# Altium project Probe-Scope v1.0.PrjPCB
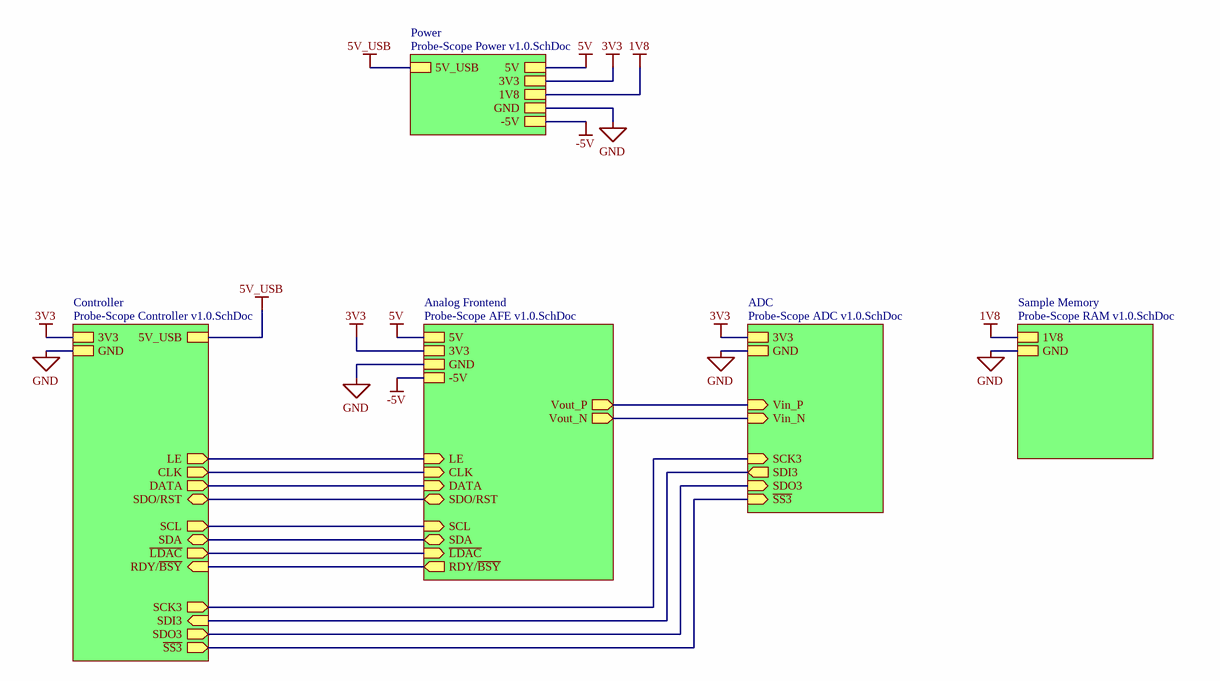
[diagram p0: Probe-Scope Top v1.0.SchDoc]
sheetcount: 6; schematic: SCH0100; revisionfull: v1.0.0; revision: v1.0; assembly: ASP0100
6 sheets, 135 parts. Net scope: strictly hierarchical (ports join the sheet entries above them; power ports are local).
Board file: Probe-Scope v1.0.PcbDoc
Sheets:
  Probe-Scope Top v1.0.SchDoc
    Analog Frontend = Probe-Scope AFE v1.0.SchDoc
    ADC = Probe-Scope ADC v1.0.SchDoc
    Sample Memory = Probe-Scope RAM v1.0.SchDoc
    Controller = Probe-Scope Controller v1.0.SchDoc
    Power = Probe-Scope Power v1.0.SchDoc

## Sheet Probe-Scope Top v1.0.SchDoc: Probe-Scope: Overview
size Letter; CompanyName: Probe-Scope; Organization: Probe-Scope; Address1: Probe-Scope: Unified USB; Address2: Oscilloscope Probe; Address3: ©2019 M. Omo, J. Rowley,; DocumentNumber: SCH0100; Revision: v1.0.0; SheetNumber: 1; SheetTotal: 6; PageSetup: Record=PageOptions|CenterHorizontal=True|CenterVertical=True|PrintScale=0.96|XCorrection=1.00|YCorrection=1.00|PrintKind=1|BorderSize=5000000|LeftOffset=0|BottomOffset=0|Orientation=2|PaperLength=1000|PaperWidth=1000|Scale=100|PaperSource=7|PrintQuality=-4|MediaType=1|DitherType=10|PaperKind=11x17|PrintScaleMode=1; Assembly: ASP0100; Address4: K. Hall, released under the; License: CERN OHL v1.2

### Sub-sheets
ADC = Probe-Scope ADC v1.0.SchDoc: Vin_P (in), Vin_N (in), 3V3, GND, SDO3 (in), ~{SS3} (in), SDI3 (out), SCK3 (in)
Analog Frontend = Probe-Scope AFE v1.0.SchDoc: -5V, Vout_N (out), RDY/~{BSY} (out), CLK (in), Vout_P (out), GND, ~{LDAC} (in), SDA (bidir), DATA (in), 3V3, LE (in), 5V, SDO/RST (bidir), SCL (in)
Controller = Probe-Scope Controller v1.0.SchDoc: SCK3 (out), SDO3 (out), SDO/RST (bidir), DATA (out), ~{LDAC} (out), ~{SS3} (out), SDI3 (in), SCL (out), CLK (out), RDY/~{BSY} (in), SDA (bidir), LE (out), 3V3, GND, 5V_USB
Power = Probe-Scope Power v1.0.SchDoc: 3V3, 5V_USB, 5V, -5V, 1V8, GND
Sample Memory = Probe-Scope RAM v1.0.SchDoc: GND, 1V8

### Nets
1V8: sheet Sample Memory/1V8, sheet Power/1V8
3V3: sheet Analog Frontend/3V3, sheet ADC/3V3, sheet Controller/3V3, sheet Power/3V3
5V: sheet Analog Frontend/5V, sheet Power/5V
5V_USB: sheet Controller/5V_USB, sheet Power/5V_USB
-5V: sheet Analog Frontend/-5V, sheet Power/-5V
GND: sheet Analog Frontend/GND, sheet ADC/GND, sheet Sample Memory/GND, sheet Controller/GND, sheet Power/GND
DAC_RDY: sheet Analog Frontend/RDY/~{BSY}, sheet Controller/RDY/~{BSY}
~{LDAC}: sheet Analog Frontend/~{LDAC}, sheet Controller/~{LDAC}
~{SS3}: sheet ADC/~{SS3}, sheet Controller/~{SS3}
~{SS4}: sheet Analog Frontend/LE, sheet Controller/LE
SCK3: sheet ADC/SCK3, sheet Controller/SCK3
SCK4: sheet Analog Frontend/CLK, sheet Controller/CLK
SCL4: sheet Analog Frontend/SCL, sheet Controller/SCL
SDA4: sheet Analog Frontend/SDA, sheet Controller/SDA
SDI3: sheet ADC/SDI3, sheet Controller/SDI3
SDI4: sheet Analog Frontend/SDO/RST, sheet Controller/SDO/RST
SDO3: sheet ADC/SDO3, sheet Controller/SDO3
SDO4: sheet Analog Frontend/DATA, sheet Controller/DATA
Vin_N: sheet Analog Frontend/Vout_N, sheet ADC/Vin_N
Vin_P: sheet Analog Frontend/Vout_P, sheet ADC/Vin_P

### Notes on the sheet
- Title:
- Asm:
- Date:
- Variant:
- Time:
- Number:
- Sheet
- of
- Rev:
- File:

## Sheet Probe-Scope AFE v1.0.SchDoc: Probe-Scope: Analog Frontend
size Tabloid; CompanyName: Probe-Scope; Organization: Probe-Scope; Address1: Probe-Scope: Unified USB; Address2: Oscilloscope Probe; Address3: ©2019 M. Omo, J. Rowley,; DocumentNumber: SCH0100; Revision: v1.0.0; SheetNumber: 3; SheetTotal: 6; PageSetup: Record=PageOptions|CenterHorizontal=True|CenterVertical=True|PrintScale=0.96|XCorrection=1.00|YCorrection=1.00|PrintKind=1|BorderSize=5000000|LeftOffset=0|BottomOffset=0|Orientation=2|PaperLength=1000|PaperWidth=1000|Scale=100|PaperSource=7|PrintQuality=-4|MediaType=1|DitherType=10|PaperKind=11x17|PrintScaleMode=1; Assembly: ASP0100; Address4: K. Hall, released under the; License: CERN OHL v1.2
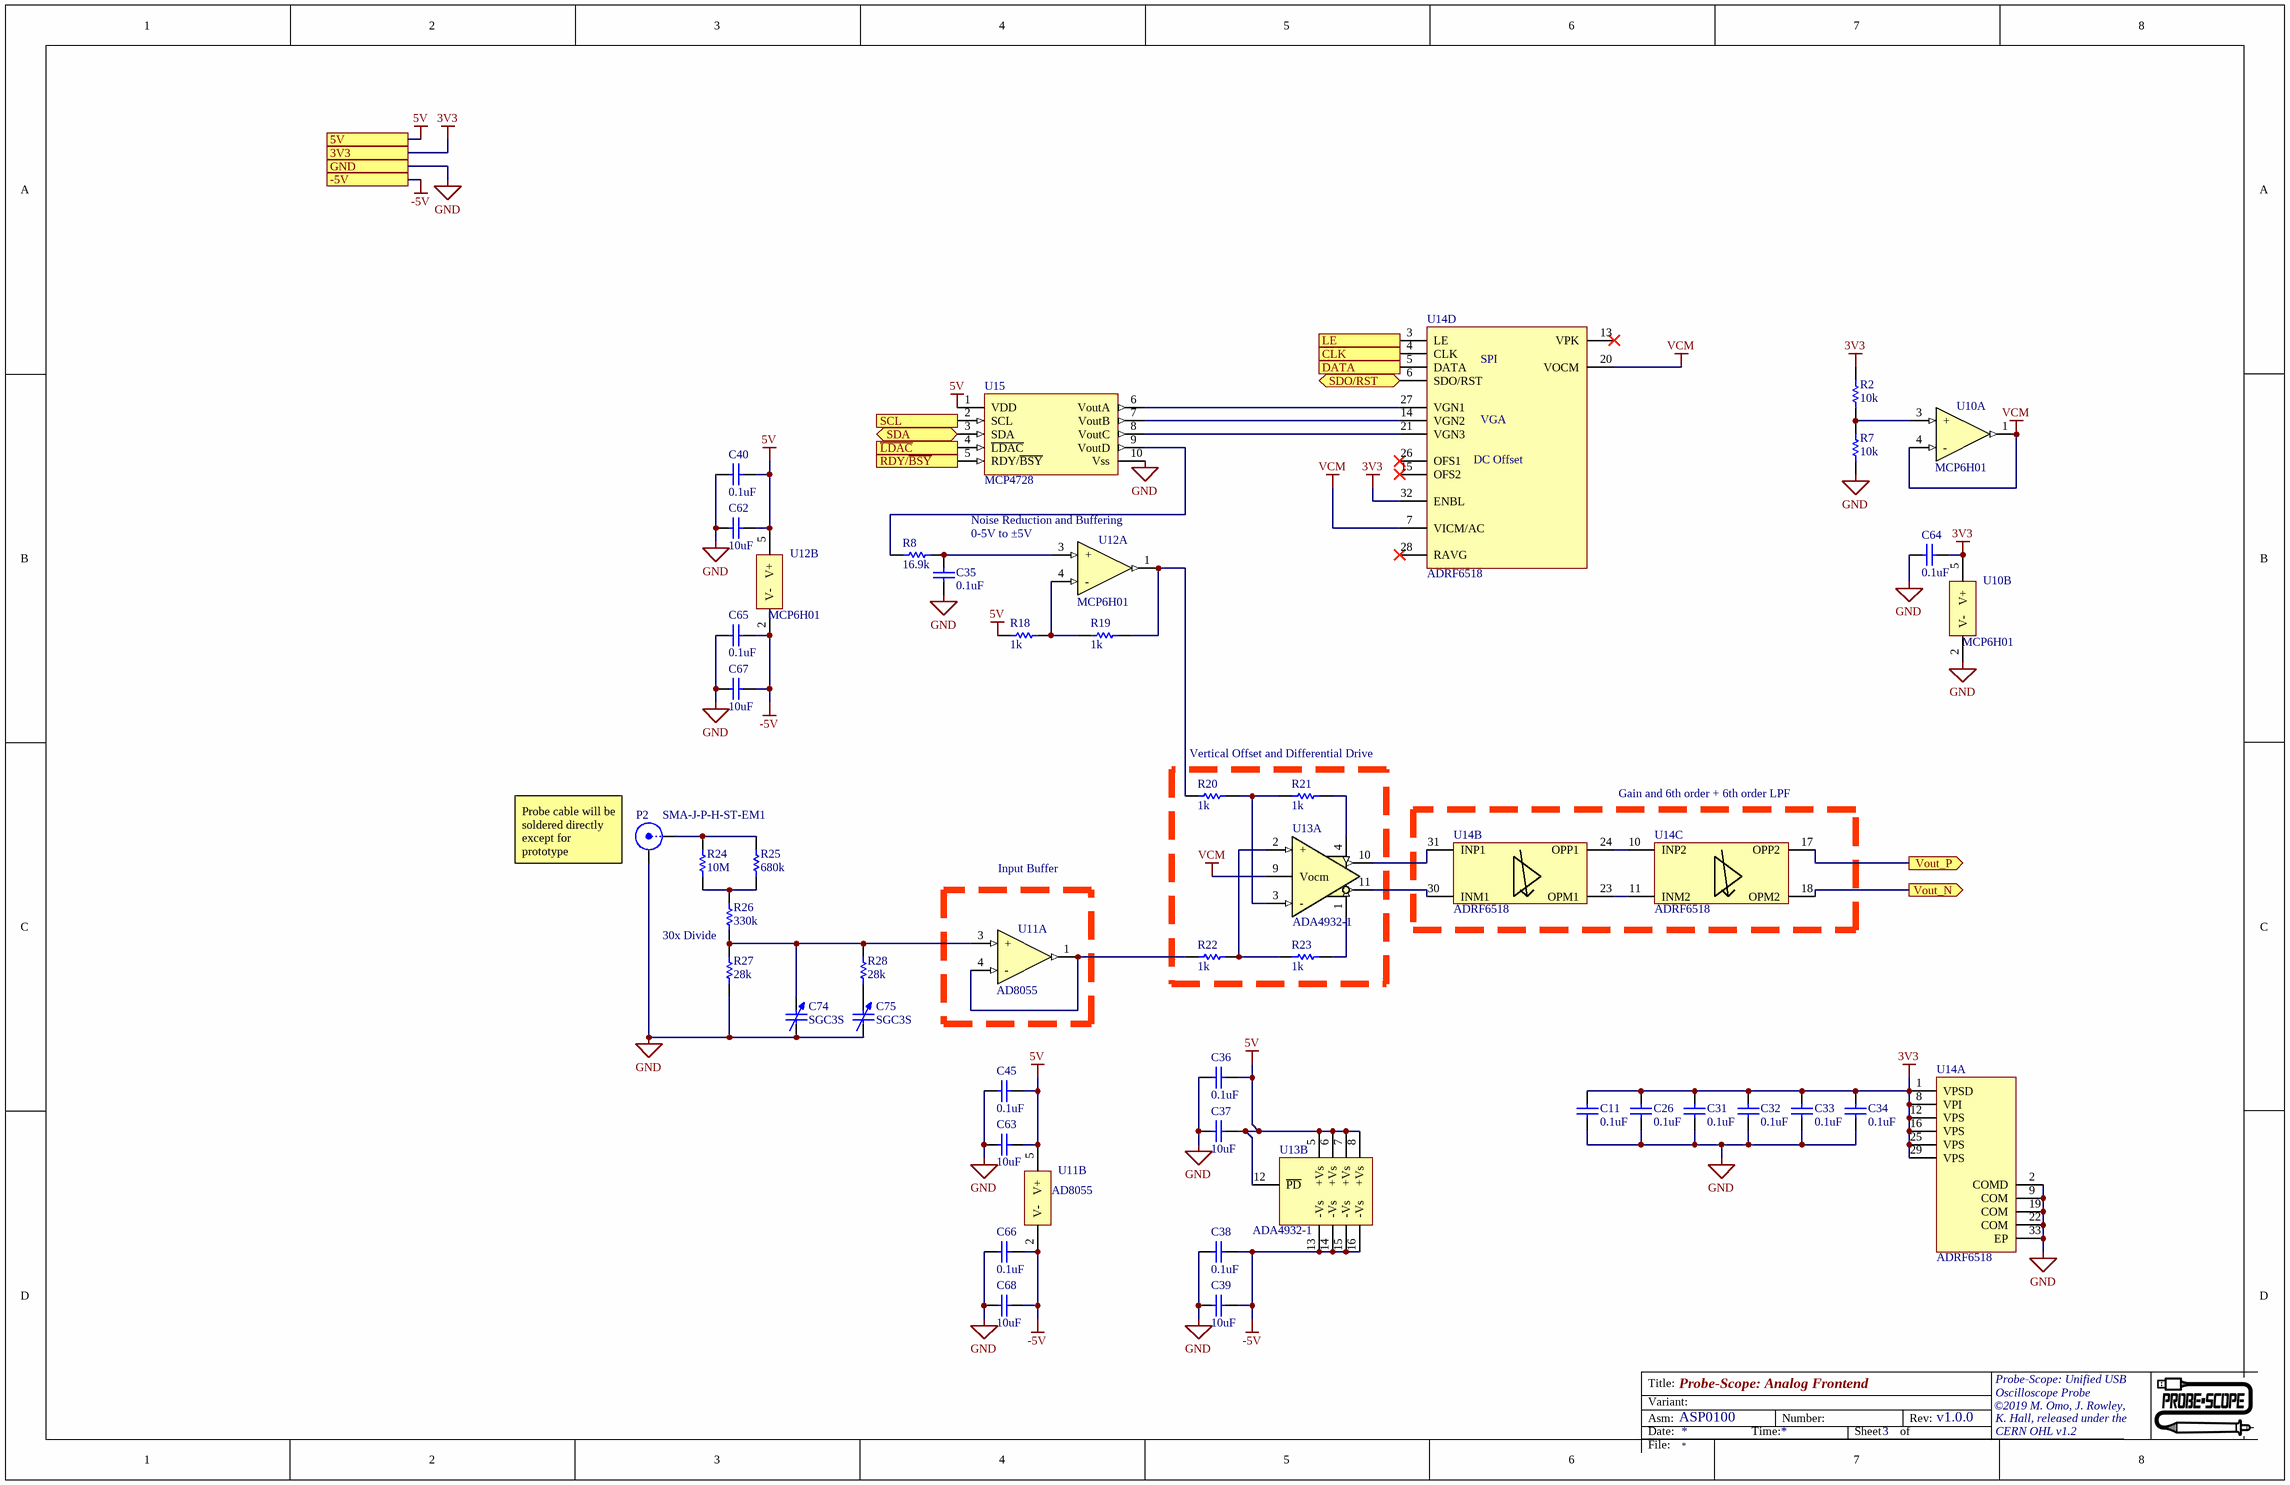
[diagram p1: Probe-Scope AFE v1.0.SchDoc]

### Parts
C11  value 0.1uF  [0402(1005)]  (hidden comment: 6.3V)
C26  value 0.1uF  [0402(1005)]  (hidden comment: 6.3V)
C31  value 0.1uF  [0402(1005)]  (hidden comment: 6.3V)
C32  value 0.1uF  [0402(1005)]  (hidden comment: 6.3V)
C33  value 0.1uF  [0402(1005)]  (hidden comment: 6.3V)
C34  value 0.1uF  [0402(1005)]  (hidden comment: 6.3V)
C35  value 0.1uF  [0402(1005)]  (hidden comment: 6.3V)
C36  value 0.1uF  [0402(1005)]  (hidden comment: 6.3V)
C37  value 10uF  [0603(1608)]  (hidden comment: 25V)
C38  value 0.1uF  [0402(1005)]  (hidden comment: 6.3V)
C39  value 10uF  [0603(1608)]  (hidden comment: 25V)
C40  value 0.1uF  [0402(1005)]  (hidden comment: 6.3V)
C45  value 0.1uF  [0402(1005)]  (hidden comment: 6.3V)
C62  value 10uF  [0603(1608)]  (hidden comment: 25V)
C63  value 10uF  [0603(1608)]  (hidden comment: 25V)
C64  value 0.1uF  [0402(1005)]  (hidden comment: 6.3V)
C65  value 0.1uF  [0402(1005)]  (hidden comment: 6.3V)
C66  value 0.1uF  [0402(1005)]  (hidden comment: 6.3V)
C67  value 10uF  [0603(1608)]  (hidden comment: 25V)
C68  value 10uF  [0603(1608)]  (hidden comment: 25V)
C74  SGC3S  [SGC3S]
C75  SGC3S  [SGC3S]
P2  SMA-J-P-H-ST-EM1  [*SMA-J-P-H-ST-EM1_SMA-J-P-H-ST-EM1(Primary)]
R2  value 10k  [0402(1005)]  (hidden comment: 0.1% 25ppm)
R7  value 10k  [0402(1005)]  (hidden comment: 0.1% 25ppm)
R8  value 16.9k  [0603(1608)]  (hidden comment: Res1)
R18  1k  [0402(1005)]
R19  1k  [0402(1005)]
R20  1k  [0402(1005)]
R21  1k  [0402(1005)]
R22  1k  [0402(1005)]
R23  1k  [0402(1005)]
R24  value 10M  [0402(1005)]  (hidden comment: Res1)
R25  value 680k  [0402(1005)]  (hidden comment: Res1)
R26  value 330k  [0402(1005)]  (hidden comment: Res1)
R27  value 28k  [0402(1005)]  (hidden comment: Res1)
R28  value 28k  [0402(1005)]  (hidden comment: Res1)
U10  MCP6H01  [SOT23-5]  (parts A,B of 2)
U11  AD8055  [SOT95P280X145-5L]  (parts A,B of 2)
U12  MCP6H01  [SOT23-5]  (parts A,B of 2)
U13  ADA4932-1  [QFN50P300X300X80_HS-17L]  (parts A,B of 2)
U14  ADRF6518  [QFN50P500X500X80_HS-33L]  (parts A,B,C,D of 4)
U15  MCP4728  [MSOP-10]

### Blocks framed on the sheet
Vertical Offset and Differential Drive: R20-R23 U13
Gain and 6th order + 6th order LPF: U14
Input Buffer: U11

### Ports
3V3, 5V, -5V, CLK (in), DATA (in), GND, LE (in), RDY/~{BSY} (out), SCL (in), SDA (bidir), SDO/RST (bidir), Vout_N (out), Vout_P (out), ~{LDAC} (in)

### Nets
3V3: C11.2 C26.2 C31.2 C32.2 C33.2 C34.2 C64.2 R2.2 U10.5(V+) U14.1(VPSD) U14.8(VPI) U14.12(VPS) U14.16(VPS) U14.25(VPS) U14.29(VPS) U14.32(ENBL) ; port 3V3
5V: C36.2 C37.2 C40.2 C45.2 C62.2 C63.2 R18.1 U11.5(V+) U12.5(V+) U13.5(+Vs) U13.6(+Vs) U13.7(+Vs) U13.8(+Vs) U13.12(~{PD}) U15.1(VDD) ; port 5V
-5V: C38.2 C39.2 C65.2 C66.2 C67.2 C68.2 U11.2(V-) U12.2(V-) U13.13(-Vs) U13.14(-Vs) U13.15(-Vs) U13.16(-Vs) ; port -5V
GND: C11.1 C26.1 C31.1 C32.1 C33.1 C34.1 C35.1 C36.1 C37.1 C38.1 C39.1 C40.1 C45.1 C62.1 C63.1 C64.1 C65.1 C66.1 C67.1 C68.1 C74.1 C75.1 P2.2(Y) R7.1 R27.1 U10.2(V-) U14.2(COMD) U14.9(COM) U14.19(COM) U14.22(COM) U14.33(EP) U15.10(Vss) ; port GND
VCM: U10.1(OUT) U10.4(-) U13.9(Vocm) U14.7(VICM/AC) U14.20(VOCM)
DAC_RDY: U15.5(RDY/~{BSY}) ; port RDY/~{BSY}
~{LDAC}: U15.4(~{LDAC}) ; port ~{LDAC}
~{SS4}: U14.3(LE) ; port LE
SCK4: U14.4(CLK) ; port CLK
SCL4: U15.2(SCL) ; port SCL
SDA4: U15.3(SDA) ; port SDA
SDI4: U14.6(SDO/RST) ; port SDO/RST
SDO4: U14.5(DATA) ; port DATA
Vin_N: U14.18(OPM2) ; port Vout_N
Vin_P: U14.17(OPP2) ; port Vout_P
NetC35_2: C35.2 R8.2 U12.3(+)
NetC74_2: C74.2 R26.1 R27.2 R28.2 U11.3(+)
NetC75_2: C75.2 R28.1
NetP2_1: P2.1(X) R24.2 R25.2
NetR2_1: R2.1 R7.2 U10.3(+)
NetR8_1: R8.1 U15.9(VoutD)
NetR18_2: R18.2 R19.1 U12.4(-)
NetR19_2: R19.2 R20.1 U12.1(OUT)
NetR20_2: R20.2 R21.1 U13.3(-)
NetR21_2: R21.2 U13.4(+FB)
NetR22_1: R22.1 U11.1(OUT) U11.4(-)
NetR22_2: R22.2 R23.1 U13.2(+)
NetR23_2: R23.2 U13.1(-FB)
NetR24_1: R24.1 R25.1 R26.2
NetU13_10: U13.10(+out) U14.31(INP1)
NetU13_11: U13.11(-Out) U14.30(INM1)
NetU14_10: U14.10(INP2) U14.24(OPP1)
NetU14_11: U14.11(INM2) U14.23(OPM1)
NetU14_14: U14.14(VGN2) U15.7(VoutB)
NetU14_21: U14.21(VGN3) U15.8(VoutC)
NetU14_27: U14.27(VGN1) U15.6(VoutA)

Not connected (* = marked no-connect by the designer): U14 13(VPK)* 15(OFS2)* 26(OFS1)* 28(RAVG)*

### Notes on the sheet
- (near U12) Noise Reduction and Buffering
- 0-5V to ±5V
- (near P2) Probe cable will be soldered directly except for prototype
- (near R26) 30x Divide
- Title:
- Asm:
- Date:
- Variant:
- Time:
- Number:
- Sheet
- of
- Rev:
- File:
- (in symbol ADRF6518, part D) SPI; VGA; DC Offset

### Library data of the parts
C11 C26 C31-C36 C38 C40 C45 C64-C66 = 1875: Key: 1875; MENG_PN: ???1875; MANF: Samsung Electro-Mechanics; MANF_PN: CL05B104KQ5NNNC; VENDOR: Digikey; VENDOR_PN: 1276-1511-1-ND; P&V Description: Capacitor, Ceramic, 0.1uF, 6.3V, 10% Tol, 125C, X7R, 0402, SMD; Class: Capacitor; Type: Ceramic; Other: X7R; Tolerance: 10; Voltage: 6.3; Max Temperature: 125; Approved: False; Package: 0402; SMD: True; Date Modified: 11/6/2018 11:14:02 AM; Modified By: jrowley; Parent Key: 1875; Verified: False
C37 C39 C62 C63 C67 C68 = 1306: Key: 1306; MENG_PN: ???1306; MANF: Samsung Electro-Mechanics; MANF_PN: CL10A106MA8NRNC; VENDOR: Digikey; VENDOR_PN: 1276-1869-1-ND; P&V Description: Capacitor, Ceramic, 10uF, 25V, 20% Tol, 85C, X5R, 0603, SMD; Class: Capacitor; Type: Ceramic; Other: X5R; Tolerance: 20; Voltage: 25; Max Temperature: 85; Approved: True; Package: 0603; SMD: True; Date Modified: 3/3/2015 11:08:29 AM; Modified By: sotterbacher; Parent Key: 1306; Verified: True
C74 C75 = VarCap
P2 = SMA-J-P-H-ST-EM1: MANF: Samtec Inc.; VENDOR: Digikey; VENDOR_PN: SAM8857-ND; MANF_PN: SMA-J-P-H-ST-EM1
R2 R7 = 1806: KEY: 1806; MENG_PN: ???1806; MANF: Stackpole Electronics; MANF_PN: RMCF0402FT10K0; VENDOR: Digikey; VENDOR_PN: RMCF0402FT10K0CT-ND; P&V Description: Resistor, Thick Film, 10k Ohms, 0.0625W, 1% Tol, 100V, 0402, SMD; Class: Resistor; Tolerance: 1; Power: 0.0625; Voltage: 100; Approved: False; Type: Thick Film; Package: 0402; SMD: True; Date Modified: 8/27/2018 6:34:02 PM; Modified By: jrowley; Expr1026: 1806; Parent Key: 1806; Verified: False
R8 = 1011: Key: 1011; MENG_PN: ???1011; MANF: Panasonic; MANF_PN: ERJ-3EKF1692V; VENDOR: Digikey; VENDOR_PN: P16.9KHCT-ND; P&V Description: Resistor, Thick Film, 16.9k Ohms, 0.1W, 1% Tol, 0603, SMD; Class: Resistor; Tolerance: 1; Power: 0.1; Approved: True; Type: Thick Film; Package: 0603; SMD: True; Date Modified: 8/12/2013 4:27:29 PM; Modified By: sotterbacher; Expr1026: 1011; Parent Key: 1011; Verified: True
R18-R23 = 1982: KEY: 1982; MENG_PN: ???1982; MANF: Yageo; MANF_PN: RC0402FR-071KL; VENDOR: Digikey; VENDOR_PN: 311-1.00KLRCT-ND; P&V Description: Resistor, Thick Film, 1k Ohms, 0.063W, 1% Tol, 1kOhm, 1%, 1/16W, Thick Film, 0402, SMD; Class: Resistor; Other: 1kOhm, 1%, 1/16W, Thick Film; Tolerance: 1; Power: 0.063; Approved: False; Value: 1k; Type: Thick Film; Package: 0402; SMD: True; Date Modified: 3/25/2019 11:32:32 AM; Modified By: jrowley; Expr1026: 1982; Parent Key: 1982; Verified: False
R24 = 2070: Key: 2070; MENG_PN: ???2070; MANF: Vishay Dale; MANF_PN: CRCW040210M0FKEDC; VENDOR: Digikey; VENDOR_PN: 541-4068-1-ND; P&V Description: Resistor, Thick Film, 10M Ohms, 0.063W, 1% Tol, 0402, SMD; Class: Resistor; Tolerance: 1; Power: 0.063; Approved: False; Type: Thick Film; Package: 0402; SMD: True; Date Modified: 6/20/2019 8:44:42 PM; Modified By: momo; Expr1026: 2070; Parent Key: 2070; Verified: False
R25 = 2069: Key: 2069; MENG_PN: ???2069; MANF: Vishay Dale; MANF_PN: CRCW0402680KJNED; VENDOR: Digikey; VENDOR_PN: 541-680KJCT-ND; P&V Description: Resistor, Thick Film, 680k Ohms, 0.063W, 1% Tol, 0402, SMD; Class: Resistor; Tolerance: 1; Power: 0.063; Approved: False; Type: Thick Film; Package: 0402; SMD: True; Date Modified: 6/20/2019 8:41:19 PM; Modified By: momo; Expr1026: 2069; Parent Key: 2069; Verified: False
R26 = 2068: Key: 2068; MENG_PN: ???2068; MANF: Vishay Dale; MANF_PN: CRCW0402330KFKEDHP; VENDOR: Digikey; VENDOR_PN: 541-330KYCT-ND; P&V Description: Resistor, Thick Film, 330k Ohms, 0.2W, 1% Tol, 0402, SMD; Class: Resistor; Tolerance: 1; Power: 0.2; Approved: False; Type: Thick Film; Package: 0402; SMD: True; Date Modified: 6/20/2019 8:37:56 PM; Modified By: momo; Expr1026: 2068; Parent Key: 2068; Verified: False
R27 R28 = 2071: Key: 2071; MENG_PN: ???2071; MANF: Vishay Dale; MANF_PN: CRCW040228K0FKED; VENDOR: Digikey; VENDOR_PN: 541-28.0KLCT-ND; P&V Description: Resistor, Thick Film, 28k Ohms, 0.063W, 1% Tol, 0402, SMD; Class: Resistor; Tolerance: 1; Power: 0.063; Approved: False; Type: Thick Film; Package: 0402; SMD: True; Date Modified: 6/20/2019 8:52:22 PM; Modified By: momo; Expr1026: 2071; Parent Key: 2071; Verified: False
U10 U12 = 2108: Key: 2108; MENG_PN: ???2108; MANF: Microchip; MANF_PN: MCP6H01T-E/OT; VENDOR: Digikey; VENDOR_PN: MCP6H01T-E/OTCT-ND; P&V Description: IC, Op Amp, 3.5V to 16V, SOT-23-5, SMD; Class: IC; Other: 3.5V to 16V; Approved: False; Type: Op Amp; Package: SOT-23-5; SMD: True; Date Modified: 7/10/2019 7:11:20 PM; Modified By: momo; Parent Key: 2108; Verified: False
U11 = AD8055: MANF: Analog Devices Inc.; MANF_PN: AD8055ARTZ-REEL7; VENDOR: DigiKey; VENDOR_PN: AD8055ARTZ-REEL7CT-ND
U13 = ADA4932: MANF: Analog Devices Inc.; MANF_PN: ADA4932-1YCPZ-R7; VENDOR: DigiKey; VENDOR_PN: ADA4932-1YCPZ-R7CT-ND
U14 = ADRF6518: MANF: Analog Devices Inc.; MANF_PN: ADRF6518ACPZ-R7; VENDOR: DigiKey; VENDOR_PN: ADRF6518ACPZ-R7TR-ND
U15 = MCP4728: MANF: Microchip Technology; MANF_PN: MCP4728T-E/UN; VENDOR: DigiKey; VENDOR_PN: MCP4728T-E/UNCT-ND

## Sheet Probe-Scope ADC v1.0.SchDoc: Probe-Scope: ADC
size Tabloid; CompanyName: Probe-Scope; Organization: Probe-Scope; Address1: Probe-Scope: Unified USB; Address2: Oscilloscope Probe; Address3: ©2019 M. Omo, J. Rowley,; Address4: K. Hall, released under the; DocumentNumber: SCH0100; SheetNumber: 4; SheetTotal: 6; PageSetup: Record=PageOptions|CenterHorizontal=True|CenterVertical=True|PrintScale=0.96|XCorrection=1.00|YCorrection=1.00|PrintKind=1|BorderSize=5000000|LeftOffset=0|BottomOffset=0|Orientation=2|PaperLength=1000|PaperWidth=1000|Scale=100|PaperSource=7|PrintQuality=-4|MediaType=1|DitherType=10|PaperKind=11x17|PrintScaleMode=1; Assembly: ASP0100; License: CERN OHL v1.2
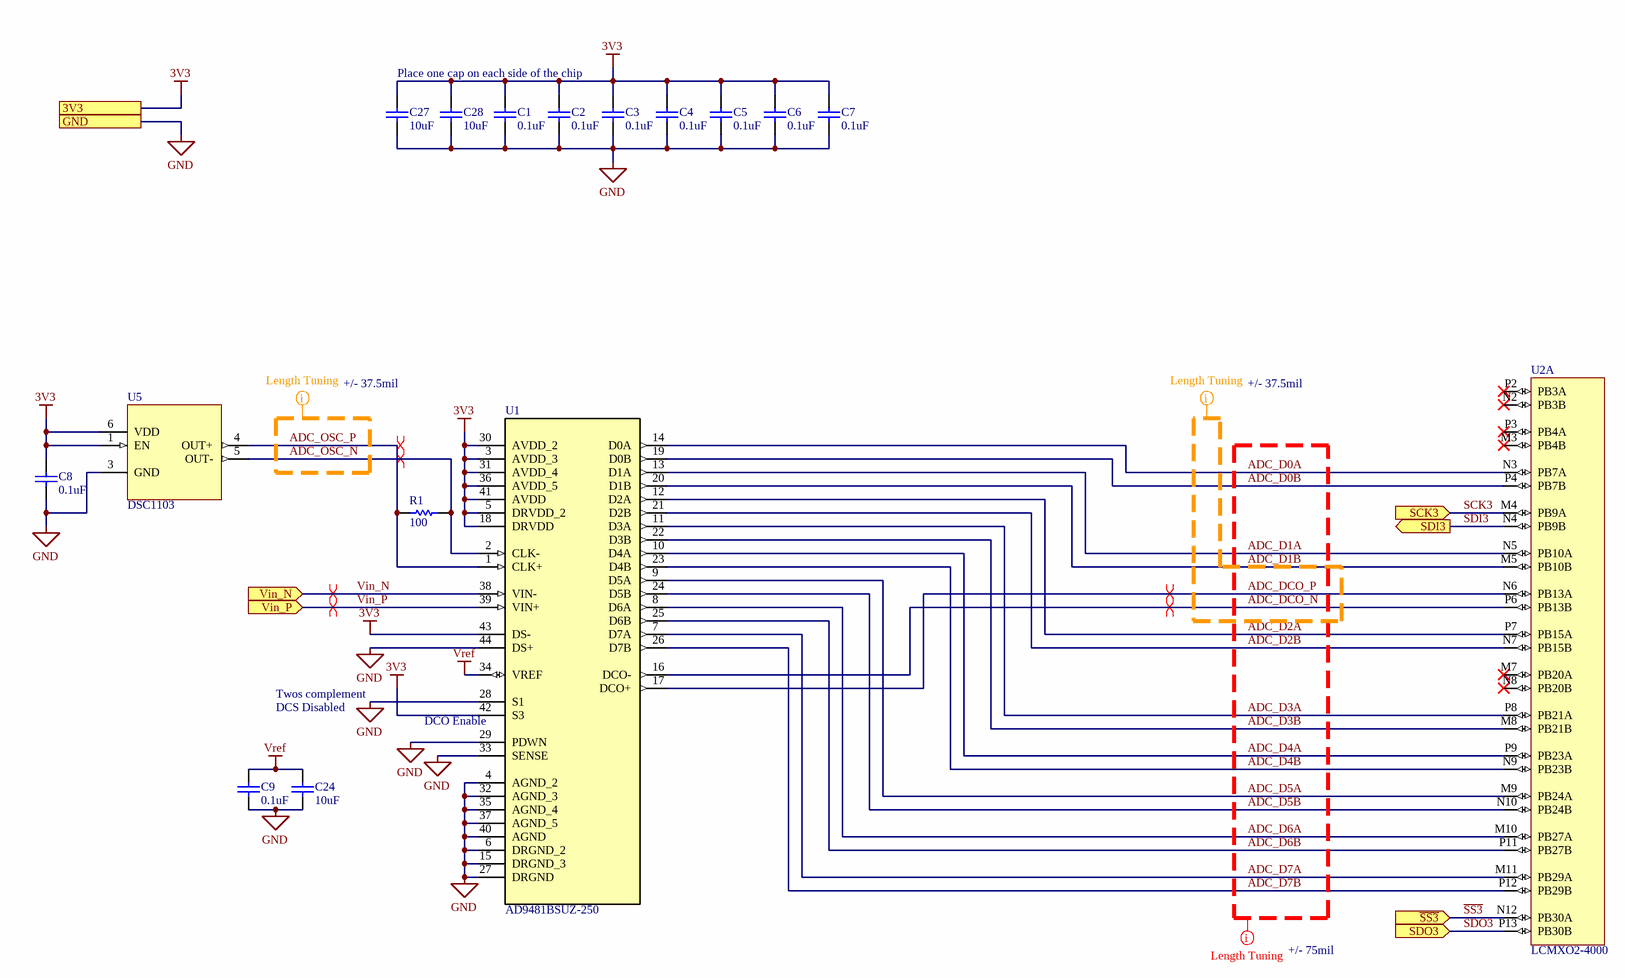
[diagram p2: Probe-Scope ADC v1.0.SchDoc]

### Parts
C1  value 0.1uF  [0402(1005)]  (hidden comment: 6.3V)
C2  value 0.1uF  [0402(1005)]  (hidden comment: 6.3V)
C3  value 0.1uF  [0402(1005)]  (hidden comment: 6.3V)
C4  value 0.1uF  [0402(1005)]  (hidden comment: 6.3V)
C5  value 0.1uF  [0402(1005)]  (hidden comment: 6.3V)
C6  value 0.1uF  [0402(1005)]  (hidden comment: 6.3V)
C7  value 0.1uF  [0402(1005)]  (hidden comment: 6.3V)
C8  value 0.1uF  [0402(1005)]  (hidden comment: 6.3V)
C9  value 0.1uF  [0402(1005)]  (hidden comment: 6.3V)
C24  value 10uF  [0603(1608)]  (hidden comment: 25V)
C27  value 10uF  [0603(1608)]  (hidden comment: 25V)
C28  value 10uF  [0603(1608)]  (hidden comment: 25V)
R1  value 100  [0402(1005)]  (hidden comment: Res1)
U1  AD9481BSUZ-250  [QFP80P1200X1200X120-44N]
U2  LCMXO2-4000  [132_Ball_csBGA_MachXO2]  (part A of 5)
U5  DSC1103  [MCHP_H5A]

### Ports
3V3, GND, SCK3 (in), SDI3 (out), SDO3 (in), Vin_N (in), Vin_P (in), ~{SS3} (in)

### Nets
3V3: C1.2 C2.2 C3.2 C4.2 C5.2 C6.2 C7.2 C8.2 C27.2 C28.2 U1.3(AVDD_3) U1.5(DRVDD_2) U1.18(DRVDD) U1.30(AVDD_2) U1.31(AVDD_4) U1.36(AVDD_5) U1.41(AVDD) U1.42(S3) U1.43(DS-) U5.1(EN) U5.6(VDD) ; port 3V3
GND: C1.1 C2.1 C3.1 C4.1 C5.1 C6.1 C7.1 C8.1 C9.1 C24.1 C27.1 C28.1 U1.4(AGND_2) U1.6(DRGND_2) U1.15(DRGND_3) U1.27(DRGND) U1.28(S1) U1.29(PDWN) U1.32(AGND_3) U1.33(SENSE) U1.35(AGND_4) U1.37(AGND_5) U1.40(AGND) U1.44(DS+) U5.3(GND) ; port GND
Vref: C9.2 C24.2 U1.34(VREF)
ADC_D0A: U1.14(D0A) U2.N3(PB7A)
ADC_D0B: U1.19(D0B) U2.P4(PB7B)
ADC_D1A: U1.13(D1A) U2.N5(PB10A)
ADC_D1B: U1.20(D1B) U2.M5(PB10B)
ADC_D2A: U1.12(D2A) U2.P7(PB15A)
ADC_D2B: U1.21(D2B) U2.N7(PB15B)
ADC_D3A: U1.11(D3A) U2.P8(PB21A)
ADC_D3B: U1.22(D3B) U2.M8(PB21B)
ADC_D4A: U1.10(D4A) U2.P9(PB23A)
ADC_D4B: U1.23(D4B) U2.N9(PB23B)
ADC_D5A: U1.9(D5A) U2.M9(PB24A)
ADC_D5B: U1.24(D5B) U2.N10(PB24B)
ADC_D6A: U1.8(D6A) U2.M10(PB27A)
ADC_D6B: U1.25(D6B) U2.P11(PB27B)
ADC_D7A: U1.7(D7A) U2.M11(PB29A)
ADC_D7B: U1.26(D7B) U2.P12(PB29B)
ADC_DCO_N: U1.16(DCO-) U2.P6(PB13B)
ADC_DCO_P: U1.17(DCO+) U2.N6(PB13A)
ADC_OSC_N: R1.2 U1.2(CLK-) U5.5(OUT-)
ADC_OSC_P: R1.1 U1.1(CLK+) U5.4(OUT+)
~{SS3}: U2.N12(PB30A) ; port ~{SS3}
SCK3: U2.M4(PB9A) ; port SCK3
SDI3: U2.N4(PB9B) ; port SDI3
SDO3: U2.P13(PB30B) ; port SDO3
Vin_N: U1.38(VIN-) ; port Vin_N
Vin_P: U1.39(VIN+) ; port Vin_P

Not connected (* = marked no-connect by the designer): U2 M3(PB4B)* M7(PB20A)* N2(PB3B)* N8(PB20B)* P2(PB3A)* P3(PB4A)*

### Layout directives
differential pair: ADC_DCO_N, ADC_DCO_P, ADC_OSC_N, ADC_OSC_P, Vin_N, Vin_P
net class ADC_DATA - 150mil: ADC_D0A, ADC_D0B, ADC_D1A, ADC_D1B, ADC_D2A, ADC_D2B, ADC_D3A, ADC_D3B, ADC_D4A, ADC_D4B, ADC_D5A, ADC_D5B, ADC_D6A, ADC_D6B, ADC_D7A, ADC_D7B, ADC_DCO_N, ADC_DCO_P
net class ADC_CLK - 37.5mil: ADC_D1B, ADC_DCO_N, ADC_DCO_P
net class ADC_OSC - 37.5mil: ADC_OSC_N, ADC_OSC_P

### Notes on the sheet
- Place one cap on each side of the chip
- +/- 37.5mil
- Twos complement
- DCS Disabled
- (near U1) DCO Enable
- +/- 75mil
- Title:
- Asm:
- Date:
- Variant:
- Time:
- Number:
- Sheet
- of
- Rev:
- File:

### Library data of the parts
C1-C9 = 1875: as C11 on sheet Probe-Scope AFE v1.0; Package: 0402; SMD: True; Date Modified: 11/6/2018 11:14:02 AM; Modified By: jrowley; Parent Key: 1875; Verified: False
C24 C27 C28 = 1306: as C37 on sheet Probe-Scope AFE v1.0; Package: 0603; SMD: True; Date Modified: 3/3/2015 11:08:29 AM; Modified By: sotterbacher; Parent Key: 1306; Verified: True
R1 = 1823: Key: 1823; MENG_PN: ???1823; MANF: Yageo; MANF_PN: RC0402FR-07100RL; VENDOR: Digikey; VENDOR_PN: 311-100LRCT-ND; P&V Description: Resistor, Thick Film, 100 Ohms, 0.0625W, 1% Tol, 100V, 0402, SMD; Class: Resistor; Tolerance: 1; Power: 0.0625; Approved: False; Type: Thick Film; Package: 0402; SMD: True; Date Modified: 8/29/2018 2:46:23 AM; Modified By: jrowley; Voltage: 100; Expr1026: 1823; Parent Key: 1823; Verified: False
U1 = AD9481BSUZ-250: Single ADC Pipelined 250Msps 8-bit Parallel/LVDS 44-Pin TQFP Tray; VENDOR: DigiKey; MANF: Analog Devices Inc.; VENDOR_PN: AD9481BSUZ-250-ND; MANF_PN: AD9481BSUZ-250
U2 = MachXO2-4000: MANF_PN: LCMXO2-4000HC-4MG132C; MANF: Lattice Semiconductor; VENDOR: DigiKey; VENDOR_PN: 220-1458-ND
U5 = DSC1103: VENDOR: Mouser; MANF: Microchip Technology; MANF_PN: DSC1103CI3-250.0000; VENDOR_PN: 579-1103CI32500000

## Sheet Probe-Scope RAM v1.0.SchDoc: Probe-Scope: RAM
size Letter; CompanyName: Probe-Scope; Organization: Probe-Scope; Address1: Probe-Scope: Unified USB; Address2: Oscilloscope Probe; Address3: ©2019 M. Omo, J. Rowley,; Address4: K. Hall, released under the; DocumentNumber: SCH0100; SheetNumber: 5; SheetTotal: 6; PageSetup: Record=PageOptions|CenterHorizontal=True|CenterVertical=True|PrintScale=0.96|XCorrection=1.00|YCorrection=1.00|PrintKind=1|BorderSize=5000000|LeftOffset=0|BottomOffset=0|Orientation=2|PaperLength=1000|PaperWidth=1000|Scale=100|PaperSource=7|PrintQuality=-4|MediaType=1|DitherType=10|PaperKind=11x17|PrintScaleMode=1; Assembly: ASP0100; License: CERN OHL v1.2
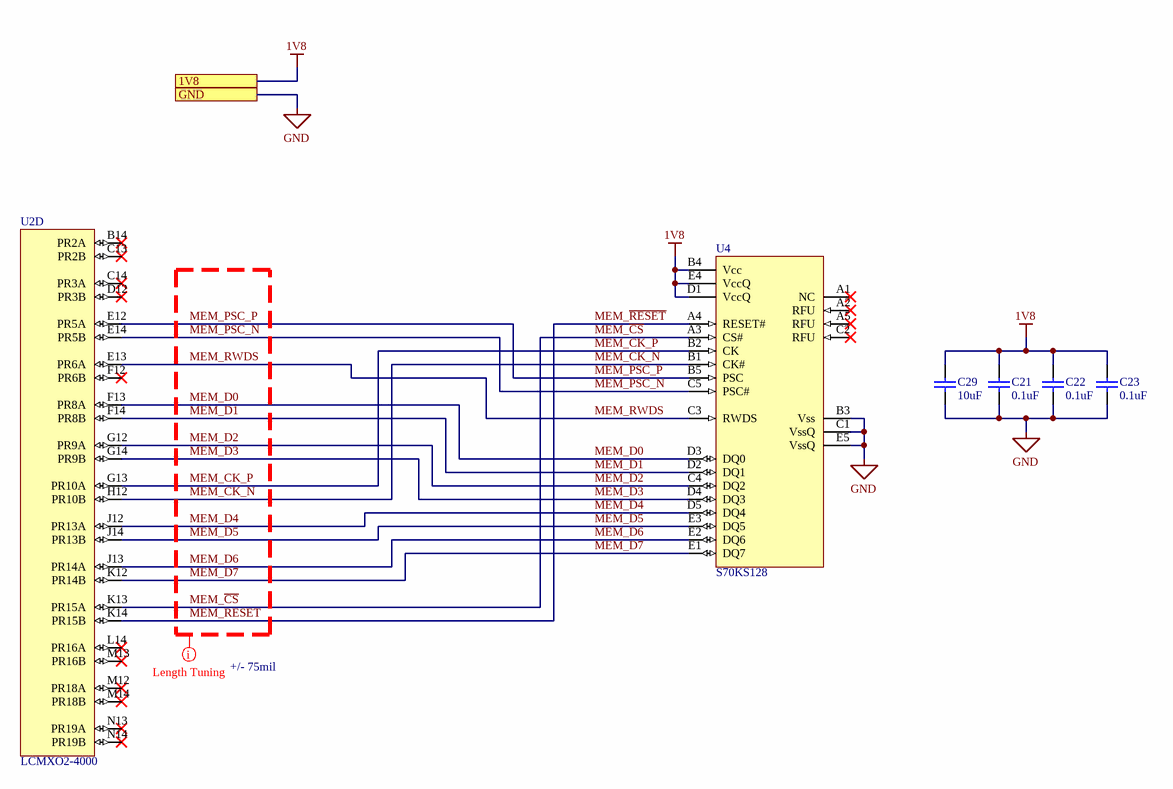
[diagram p3: Probe-Scope RAM v1.0.SchDoc]

### Parts
C21  value 0.1uF  [0402(1005)]  (hidden comment: 6.3V)
C22  value 0.1uF  [0402(1005)]  (hidden comment: 6.3V)
C23  value 0.1uF  [0402(1005)]  (hidden comment: 6.3V)
C29  value 10uF  [0603(1608)]  (hidden comment: 25V)
U2  LCMXO2-4000  [132_Ball_csBGA_MachXO2]  (part D of 5)
U4  S70KS128  [Cypress-VAA024]

### Ports
1V8, GND

### Nets
1V8: C21.2 C22.2 C23.2 C29.2 U4.B4(Vcc) U4.D1(VccQ) U4.E4(VccQ) ; port 1V8
GND: C21.1 C22.1 C23.1 C29.1 U4.B3(Vss) U4.C1(VssQ) U4.E5(VssQ) ; port GND
MEM_~{CS}: U2.K13(PR15A) U4.A3(CS#)
MEM_CK_N: U2.H12(PR10B) U4.B1(CK#)
MEM_CK_P: U2.G13(PR10A) U4.B2(CK)
MEM_D0: U2.F13(PR8A) U4.D3(DQ0)
MEM_D1: U2.F14(PR8B) U4.D2(DQ1)
MEM_D2: U2.G12(PR9A) U4.C4(DQ2)
MEM_D3: U2.G14(PR9B) U4.D4(DQ3)
MEM_D4: U2.J12(PR13A) U4.D5(DQ4)
MEM_D5: U2.J14(PR13B) U4.E3(DQ5)
MEM_D6: U2.J13(PR14A) U4.E2(DQ6)
MEM_D7: U2.K12(PR14B) U4.E1(DQ7)
MEM_PSC_N: U2.E14(PR5B) U4.C5(PSC#)
MEM_PSC_P: U2.E12(PR5A) U4.B5(PSC)
MEM_~{RESET}: U2.K14(PR15B) U4.A4(RESET#)
MEM_RWDS: U2.E13(PR6A) U4.C3(RWDS)

Not connected (* = marked no-connect by the designer): U2 B14(PR2A)* C13(PR2B)* C14(PR3A)* D12(PR3B)* F12(PR6B)* L14(PR16A)* M12(PR18A)* M13(PR16B)* M14(PR18B)* N13(PR19A)* N14(PR19B)*; U4 A1(NC)* A2(RFU)* A5(RFU)* C2(RFU)*

### Layout directives
net class MEMDDR - 150mil: MEM_CK_N, MEM_CK_P, MEM_D0, MEM_D1, MEM_D2, MEM_D3, MEM_D4, MEM_D5, MEM_D6, MEM_D7, MEM_PSC_N, MEM_PSC_P, MEM_RWDS, MEM_~{CS}, MEM_~{RESET}

### Notes on the sheet
- +/- 75mil
- Title:
- Asm:
- Date:
- Variant:
- Time:
- Number:
- Sheet
- of
- Rev:
- File:

### Library data of the parts
C21-C23 = 1875: as C11 on sheet Probe-Scope AFE v1.0; Package: 0402; SMD: True; Date Modified: 11/6/2018 11:14:02 AM; Modified By: jrowley; Parent Key: 1875; Verified: False
C29 = 1306: as C37 on sheet Probe-Scope AFE v1.0; Package: 0603; SMD: True; Date Modified: 3/3/2015 11:08:29 AM; Modified By: sotterbacher; Parent Key: 1306; Verified: True
U2 = MachXO2-4000: as U2 on sheet Probe-Scope ADC v1.0
U4 = S70KS: MANF: Cypress; MANF_PN: S70KS1281DPBHV020; VENDOR: DigiKey; VENDOR_PN: 2015-S70KS1281DPBHV020-ND

## Sheet Probe-Scope Controller v1.0.SchDoc: Probe-Scope: Controller
size Tabloid; CompanyName: Probe-Scope; Organization: Probe-Scope; Address1: Probe-Scope: Unified USB; Address2: Oscilloscope Probe; Address3: ©2019 M. Omo, J. Rowley,; Address4: K. Hall, released under the; DocumentNumber: SCH0100; SheetNumber: 2; SheetTotal: 6; PageSetup: Record=PageOptions|CenterHorizontal=True|CenterVertical=True|PrintScale=0.96|XCorrection=1.00|YCorrection=1.00|PrintKind=1|BorderSize=5000000|LeftOffset=0|BottomOffset=0|Orientation=2|PaperLength=1000|PaperWidth=1000|Scale=100|PaperSource=7|PrintQuality=-4|MediaType=1|DitherType=10|PaperKind=11x17|PrintScaleMode=1; Assembly: ASP0100; License: CERN OHL v1.2
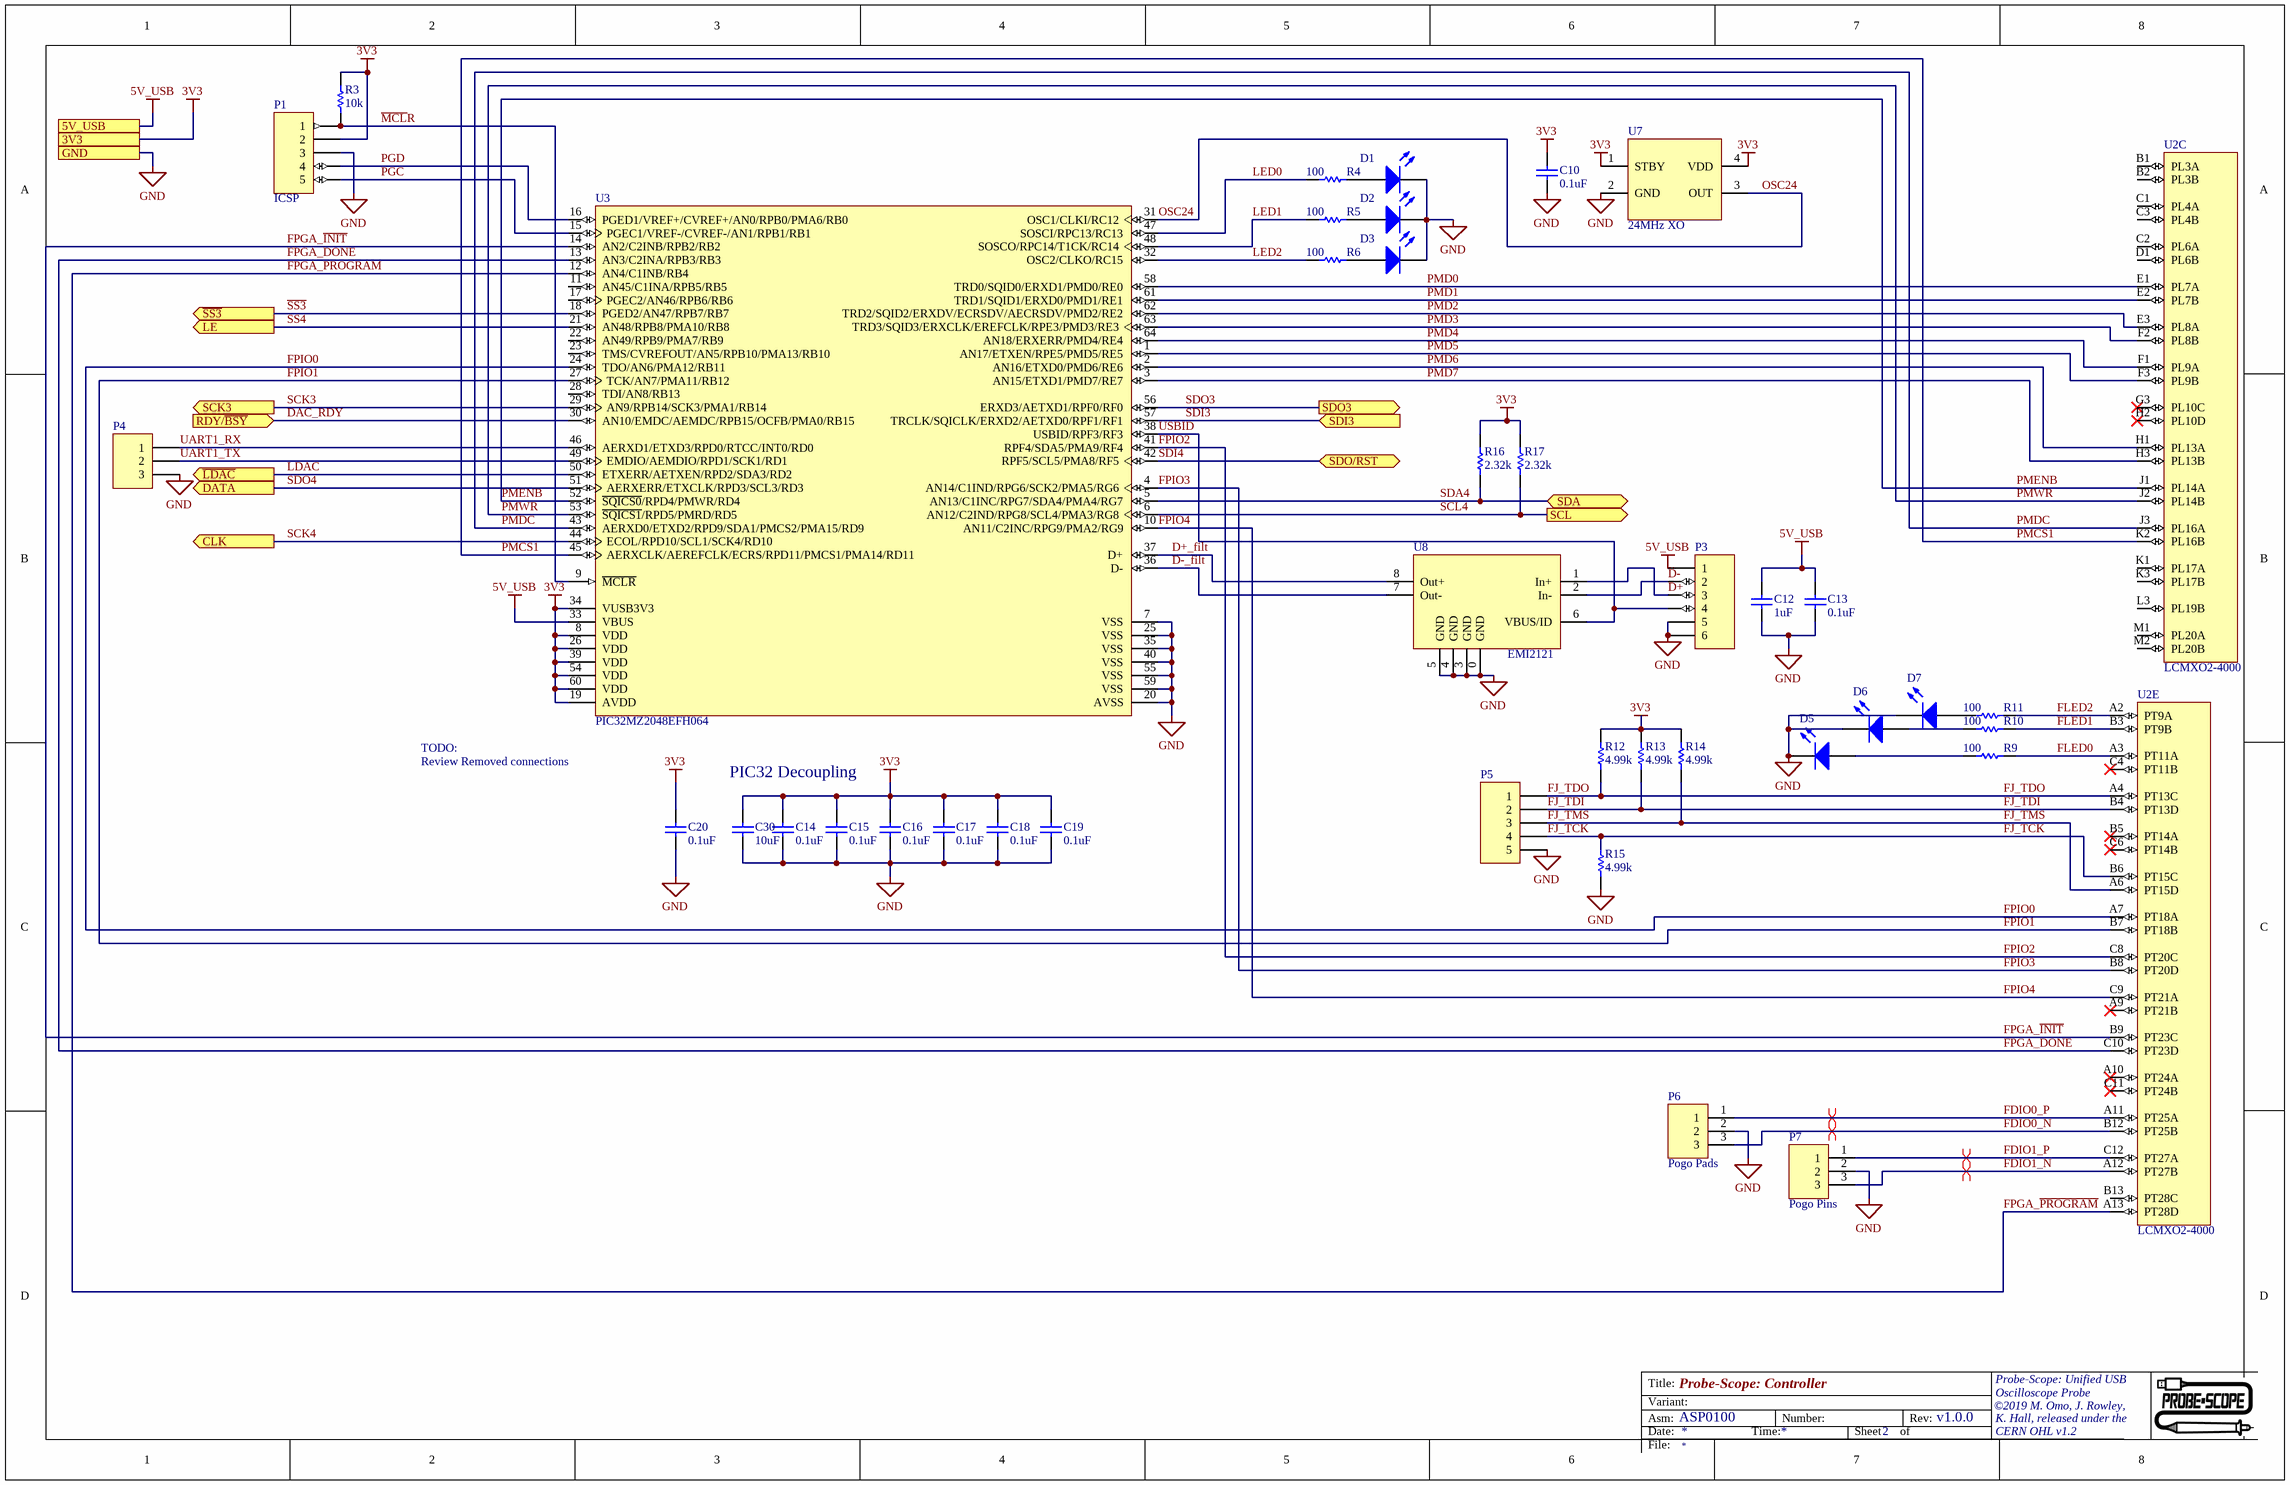
[diagram p4: Probe-Scope Controller v1.0.SchDoc]

### Parts
C10  value 0.1uF  [0402(1005)]  (hidden comment: 6.3V)
C12  value 1uF  [0402(1005)]  (hidden comment: 10V)
C13  value 0.1uF  [0402(1005)]  (hidden comment: 6.3V)
C14  value 0.1uF  [0402(1005)]  (hidden comment: 6.3V)
C15  value 0.1uF  [0402(1005)]  (hidden comment: 6.3V)
C16  value 0.1uF  [0402(1005)]  (hidden comment: 6.3V)
C17  value 0.1uF  [0402(1005)]  (hidden comment: 6.3V)
C18  value 0.1uF  [0402(1005)]  (hidden comment: 6.3V)
C19  value 0.1uF  [0402(1005)]  (hidden comment: 6.3V)
C20  value 0.1uF  [0402(1005)]  (hidden comment: 6.3V)
C30  value 10uF  [0603(1608)]  (hidden comment: 25V)
D1  Green  [0603(1608) LED]  (value not drawn)
D2  Green  [0603(1608) LED]  (value not drawn)
D3  Green  [0603(1608) LED]  (value not drawn)
D5  Green  [0603(1608) LED]  (value not drawn)
D6  Green  [0603(1608) LED]  (value not drawn)
D7  Green  [0603(1608) LED]  (value not drawn)
P1  ICSP  [MOLEX PICOBLADE 5 POS]
P3  Micro USB  [USB Micro B ZX62]  (value not drawn)
P4  PicoBlade 3  [MOLEX PICOBLADE 3 POS]  (value not drawn)
P5  PicoBlade 5  [MOLEX PICOBLADE 5 POS]  (value not drawn)
P6  Pogo Pads  [POGO_PADS_3]
P7  Pogo Pins  [POGO_PINS_3]
R3  value 10k  [0402(1005)]  (hidden comment: 0.1% 25ppm)
R4  value 100  [0402(1005)]  (hidden comment: Res1)
R5  value 100  [0402(1005)]  (hidden comment: Res1)
R6  value 100  [0402(1005)]  (hidden comment: Res1)
R9  value 100  [0402(1005)]  (hidden comment: Res1)
R10  value 100  [0402(1005)]  (hidden comment: Res1)
R11  value 100  [0402(1005)]  (hidden comment: Res1)
R12  value 4.99k  [0402(1005)]  (hidden comment: Res1)
R13  value 4.99k  [0402(1005)]  (hidden comment: Res1)
R14  value 4.99k  [0402(1005)]  (hidden comment: Res1)
R15  value 4.99k  [0402(1005)]  (hidden comment: Res1)
R16  value 2.32k  [0402(1005)]  (hidden comment: Res1)
R17  value 2.32k  [0402(1005)]  (hidden comment: Res1)
U2  LCMXO2-4000  [132_Ball_csBGA_MachXO2]  (parts C,E of 5)
U3  PIC32MZ2048EFH064  [TSQFP50P1200X1200X120-64L]
U7  24MHz XO  [DSC60xxC]
U8  EMI2121  [EMI2121]

### Ports
3V3, 5V_USB, CLK (out), DATA (out), GND, LE (out), RDY/~{BSY} (in), SCK3 (out), SCL (out), SDA (bidir), SDI3 (in), SDO3 (out), SDO/RST (bidir), ~{LDAC} (out), ~{SS3} (out)

### Nets
3V3: C10.2 C14.2 C15.2 C16.2 C17.2 C18.2 C19.2 C20.2 C30.2 P1.2 R3.2 R12.2 R13.2 R14.2 R16.2 R17.2 U3.8(VDD) U3.19(AVDD) U3.26(VDD) U3.34(VUSB3V3) U3.39(VDD) U3.54(VDD) U3.60(VDD) U7.1(STBY) U7.4(VDD) ; port 3V3
5V_USB: C12.2 C13.2 P3.1 U3.33(VBUS) ; port 5V_USB
GND: C10.1 C12.1 C13.1 C14.1 C15.1 C16.1 C17.1 C18.1 C19.1 C20.1 C30.1 D1.2(K) D2.2(K) D3.2(K) D5.2(K) D6.2(K) D7.2(K) P1.3 P3.5 P3.6 P4.3 P5.5 P6.2 P7.2 R15.1 U3.7(VSS) U3.20(AVSS) U3.25(VSS) U3.35(VSS) U3.40(VSS) U3.55(VSS) U3.59(VSS) U7.2(GND) U8.0(GND) U8.3(GND) U8.4(GND) U8.5(GND) ; port GND
~{MCL}R: P1.1 R3.1 U3.9(~{MCLR})
~{PMW}R: U2.J2(PL14B) U3.53(~{SQICS1}/RPD5/PMRD/RD5)
D+: P3.3 U8.1(In+)
D+_filt: U3.37(D+) U8.8(Out+)
D-: P3.2 U8.2(In-)
D-_filt: U3.36(D-) U8.7(Out-)
DAC_RDY: U3.30(AN10/EMDC/AEMDC/RPB15/OCFB/PMA0/RB15) ; port RDY/~{BSY}
FDIO0_N: P6.3 U2.B12(PT25B)
FDIO0_P: P6.1 U2.A11(PT25A)
FDIO1_N: P7.3 U2.A12(PT27B)
FDIO1_P: P7.1 U2.C12(PT27A)
FJ_TCK: P5.4 R15.2 U2.B6(PT15C)
FJ_TDI: P5.2 R13.1 U2.B4(PT13D)
FJ_TDO: P5.1 R12.1 U2.A4(PT13C)
FJ_TMS: P5.3 R14.1 U2.A6(PT15D)
FLED0: R9.2 U2.A3(PT11A)
FLED1: R10.2 U2.B3(PT9B)
FLED2: R11.2 U2.A2(PT9A)
FPGA_DONE: U2.C10(PT23D) U3.13(AN3/C2INA/RPB3/RB3)
FPGA_~{INIT}: U2.B9(PT23C) U3.14(AN2/C2INB/RPB2/RB2)
FPGA_~{PROGRAM}: U2.A13(PT28D) U3.12(AN4/C1INB/RB4)
FPIO0: U2.A7(PT18A) U3.24(TDO/AN6/PMA12/RB11)
FPIO1: U2.B7(PT18B) U3.27(TCK/AN7/PMA11/RB12)
FPIO2: U2.C8(PT20C) U3.41(RPF4/SDA5/PMA9/RF4)
FPIO3: U2.B8(PT20D) U3.4(AN14/C1IND/RPG6/SCK2/PMA5/RG6)
FPIO4: U2.C9(PT21A) U3.10(AN11/C2INC/RPG9/PMA2/RG9)
~{LDAC}: U3.50(ETXERR/AETXEN/RPD2/SDA3/RD2) ; port ~{LDAC}
LED0: R4.1 U3.47(SOSCI/RPC13/RC13)
LED1: R5.1 U3.48(SOSCO/RPC14/T1CK/RC14)
LED2: R6.1 U3.32(OSC2/CLKO/RC15)
OSC24: U3.31(OSC1/CLKI/RC12) U7.3(OUT)
PGC: P1.5 U3.15(PGEC1/VREF-/CVREF-/AN1/RPB1/RB1)
PGD: P1.4 U3.16(PGED1/VREF+/CVREF+/AN0/RPB0/PMA6/RB0)
PMCS1: U2.K2(PL16B) U3.45(AERXCLK/AEREFCLK/ECRS/RPD11/PMCS1/PMA14/RD11)
PMD0: U2.E1(PL7A) U3.58(TRD0/SQID0/ERXD1/PMD0/RE0)
PMD1: U2.E2(PL7B) U3.61(TRD1/SQID1/ERXD0/PMD1/RE1)
PMD2: U2.E3(PL8A) U3.62(TRD2/SQID2/ERXDV/ECRSDV/AECRSDV/PMD2/RE2)
PMD3: U2.F2(PL8B) U3.63(TRD3/SQID3/ERXCLK/EREFCLK/RPE3/PMD3/RE3)
PMD4: U2.F1(PL9A) U3.64(AN18/ERXERR/PMD4/RE4)
PMD5: U2.F3(PL9B) U3.1(AN17/ETXEN/RPE5/PMD5/RE5)
PMD6: U2.H1(PL13A) U3.2(AN16/ETXD0/PMD6/RE6)
PMD7: U2.H3(PL13B) U3.3(AN15/ETXD1/PMD7/RE7)
PMDC: U2.J3(PL16A) U3.43(AERXD0/ETXD2/RPD9/SDA1/PMCS2/PMA15/RD9)
PMENB: U2.J1(PL14A) U3.52(~{SQICS0}/RPD4/PMWR/RD4)
~{SS3}: U3.18(PGED2/AN47/RPB7/RB7) ; port ~{SS3}
~{SS4}: U3.21(AN48/RPB8/PMA10/RB8) ; port LE
SCK3: U3.29(AN9/RPB14/SCK3/PMA1/RB14) ; port SCK3
SCK4: U3.44(ECOL/RPD10/SCL1/SCK4/RD10) ; port CLK
SCL4: R17.1 U3.6(AN12/C2IND/RPG8/SCL4/PMA3/RG8) ; port SCL
SDA4: R16.1 U3.5(AN13/C1INC/RPG7/SDA4/PMA4/RG7) ; port SDA
SDI3: U3.57(TRCLK/SQICLK/ERXD2/AETXD0/RPF1/RF1) ; port SDI3
SDI4: U3.42(RPF5/SCL5/PMA8/RF5) ; port SDO/RST
SDO3: U3.56(ERXD3/AETXD1/RPF0/RF0) ; port SDO3
SDO4: U3.51(AERXERR/ETXCLK/RPD3/SCL3/RD3) ; port DATA
UART1_RX: P4.1 U3.46(AERXD1/ETXD3/RPD0/RTCC/INT0/RD0)
UART1_TX: P4.2 U3.49(EMDIO/AEMDIO/RPD1/SCK1/RD1)
USBID: P3.4 U3.38(USBID/RPF3/RF3) U8.6(VBUS/ID)
NetD1_1: D1.1(A) R4.2
NetD2_1: D2.1(A) R5.2
NetD3_1: D3.1(A) R6.2
NetD5_1: D5.1(A) R9.1
NetD6_1: D6.1(A) R10.1
NetD7_1: D7.1(A) R11.1

Not connected (* = marked no-connect by the designer): U2 A9(PT21B)* A10(PT24A)* B1(PL3A) B2(PL3B) B5(PT14A)* B13(PT28C) C1(PL4A) C2(PL6A) C3(PL4B) C4(PT11B)* C6(PT14B)* C11(PT24B)* D1(PL6B) G3(PL10C)* H2(PL10D)* K1(PL17A) K3(PL17B) L3(PL19B) M1(PL20A) M2(PL20B); U3 11(AN45/C1INA/RPB5/RB5) 17(PGEC2/AN46/RPB6/RB6) 22(AN49/RPB9/PMA7/RB9) 23(TMS/CVREFOUT/AN5/RPB10/PMA13/RB10) 28(TDI/AN8/RB13)

### Layout directives
differential pair: FDIO0_N, FDIO0_P, FDIO1_N, FDIO1_P

### Notes on the sheet
- TODO:
- Review Removed connections
- PIC32 Decoupling
- Title:
- Asm:
- Date:
- Variant:
- Time:
- Number:
- Sheet
- of
- Rev:
- File:

### Library data of the parts
C10 C13-C20 = 1875: as C11 on sheet Probe-Scope AFE v1.0; Package: 0402; SMD: True; Date Modified: 11/6/2018 11:14:02 AM; Modified By: jrowley; Parent Key: 1875; Verified: False
C12 = 1876: Key: 1876; MENG_PN: ???1876; MANF: Murata Electronics; MANF_PN: GCM155C71A105KE38D; VENDOR: Digikey; VENDOR_PN: 490-13409-1-ND; P&V Description: Capacitor, Ceramic, 1uF, 10V, 10% Tol, 125C, X7S, 0402, SMD; Class: Capacitor; Type: Ceramic; Other: X7S; Tolerance: 10; Max Temperature: 125; Approved: False; Package: 0402; SMD: True; Date Modified: 11/6/2018 11:19:13 AM; Modified By: jrowley; Voltage: 10; Parent Key: 1876; Verified: False
C30 = 1306: as C37 on sheet Probe-Scope AFE v1.0; Package: 0603; SMD: True; Date Modified: 3/3/2015 11:08:29 AM; Modified By: sotterbacher; Parent Key: 1306; Verified: True
D1-D3 D5-D7 = 798: Key: 798; MENG_PN: ???798; MANF: OSRAM; MANF_PN: LG L29K-F2J1-24; VENDOR: Digikey; VENDOR_PN: 475-1193-1-ND; P&V Description: LED, 1.7V, 0.02A, Green, 570nm, diffused, 0603, SMD; Class: LED; Other: Green, 570nm, diffused; Voltage: 1.7; Current: 0.02; Approved: True; Package: 0603; SMD: True; Date Modified: 11/4/2014 3:14:11 PM; Modified By: pmarcus; Parent Key: 798; Verified: True
P1 P5 = 1316: Key: 1316; MENG_PN: ???1316; MANF: Molex; MANF_PN: 53047-0510; VENDOR: Digikey; VENDOR_PN: WM1734-ND; P&V Description: Connector, PicoBlade, 5 Positions, Male, 0.049" Spacing, 1A, 125V, Vert, Through Hole, Locking, Tin; Class: Connector; Other: Vert, Through Hole, Locking, Tin; Current: 1; Voltage: 125; Positions: 5; Spacing: 0.049; Sex: Male; Approved: True; Type: PicoBlade; SMD: False; Date Modified: 4/3/2015 6:22:35 PM; Modified By: pmarcus; Parent Key: 1316; Verified: True
P3 = 1830: Key: 1830; MENG_PN: ???1830; MANF: Amphenol FCI; MANF_PN: 10118192-0002LF; VENDOR: Digikey; VENDOR_PN: 609-5379-1-ND; P&V Description: Connector, USB, 5 Positions, Female, 0.026" Spacing, 1.8A, 100V, USB - micro B USB 2.0 Receptacle Connector 5 Position Surface Mount, Right Angle, Without Flange, SMD; Class: Connector; Other: USB - micro B USB 2.0 Receptacle Connector 5 Position Surface Mount, Right Angle, Without Flange; Positions: 5; Sex: Female; Approved: False; Current: 1.8; Voltage: 100; Spacing: 0.026; Type: USB; SMD: True; Date Modified: 8/31/2018 2:15:27 PM; Modified By: jrowley; Parent Key: 1830; Verified: False
P4 = 1286: Key: 1286; MENG_PN: ???1286; MANF: Molex; MANF_PN: 53047-0310; VENDOR: Digikey; VENDOR_PN: WM1732-ND; P&V Description: Connector, PicoBlade, 3 Positions, Male, 0.049" Spacing, 1A, 125V, Vert, Through Hole, Locking, Tin; Class: Connector; Other: Vert, Through Hole, Locking, Tin; Current: 1; Voltage: 125; Positions: 3; Spacing: 0.049; Sex: Male; Approved: True; Type: PicoBlade; SMD: False; Date Modified: 2/19/2015 4:08:35 PM; Modified By: rlaity; Parent Key: 1286; Verified: True
P6 = POGO_PADS_3
P7 = POGO_PINS_3: MANF: Prec-Dip; MANF_PN: 811-SS-003-30-002101; VENDOR: DigiKey; VENDOR_PN: 1212-1561-ND
R3 = 1806: as R2 on sheet Probe-Scope AFE v1.0; Type: Thick Film; Package: 0402; SMD: True; Date Modified: 8/27/2018 6:34:02 PM; Modified By: jrowley; Expr1026: 1806; Parent Key: 1806; Verified: False
R4-R6 R9-R11 = 1823: KEY: 1823; MENG_PN: ???1823; MANF: Yageo; MANF_PN: RC0402FR-07100RL; VENDOR: Digikey; VENDOR_PN: 311-100LRCT-ND; P&V Description: Resistor, Thick Film, 100 Ohms, 0.0625W, 1% Tol, 100V, 0402, SMD; Class: Resistor; Tolerance: 1; Power: 0.0625; Approved: False; Type: Thick Film; Package: 0402; SMD: True; Date Modified: 8/29/2018 2:46:23 AM; Modified By: jrowley; Voltage: 100; Expr1026: 1823; Parent Key: 1823; Verified: False
R12-R15 = 1871: Key: 1871; MENG_PN: ???1871; MANF: Yageo; MANF_PN: RC0402FR-074K99L; VENDOR: Digikey; VENDOR_PN: 311-4.99KLRCT-ND; P&V Description: Resistor, Thick Film, 4.99k Ohms, 0.063W, 1% Tol, RES SMD 4.99K OHM 1% 1/16W 0402, 0402, SMD; Class: Resistor; Other: RES SMD 4.99K OHM 1% 1/16W 0402; Tolerance: 1; Power: 0.063; Approved: False; Type: Thick Film; Package: 0402; SMD: True; Date Modified: 11/5/2018 1:44:43 PM; Modified By: khall; Expr1026: 1871; Parent Key: 1871; Verified: False
R16 R17 = 1892: Key: 1892; MANF: Stackpole Electronics; MANF_PN: RMCF0402FT2K32; VENDOR: Digikey; VENDOR_PN: RMCF0402FT2K32CT-ND; P&V Description: Resistor, Thick Film, 2.32k Ohms, 0.0625W, 1% Tol, 2.32 kOhms ±1% 0.063W, 1/16W Chip Resistor 0402 (1005 Metric) Automotive AEC-Q200 Thick Film, 0402, SMD; Class: Resistor; Other: 2.32 kOhms ±1% 0.063W, 1/16W Chip Resistor 0402 (1005 Metric) Automotive AEC-Q200 Thick Film; Tolerance: 1; Power: 0.0625; Approved: False; MENG_PN: 1892; Type: Thick Film; Package: 0402; SMD: True; Date Modified: 12/12/2018 9:31:20 AM; Modified By: khall; Expr1026: 1892; Parent Key: 1892; Verified: False
U2 = MachXO2-4000: as U2 on sheet Probe-Scope ADC v1.0
U3 = PIC32MZ2048EFH064-I/PT: Microchip PIC32MZ EF Series 64-pin; VENDOR_PN: PIC32MZ2048EFH064-I/PT-ND; MANF: Microchip Technology; VENDOR: DigiKey; MANF_PN: PIC32MZ2048EFH064-I/PT
U7 = 2055: Key: 2055; MENG_PN: ???2055; MANF: Microchip; MANF_PN: DSC6011JI1A-024.0000; VENDOR: Digikey; VENDOR_PN: DSC6011JI1A-024.0000-ND; P&V Description: IC, Oscillator, 24MHz XO (Standard) CMOD Oscillator, 1.71-3.63V, Standby (Power Down), 4-SMD, SMD; Class: IC; Other: 24MHz XO (Standard) CMOD Oscillator, 1.71-3.63V, Standby (Power Down); Approved: False; Type: Oscillator; Package: 4-SMD; SMD: True; Date Modified: 6/13/2019 1:30:40 AM; Modified By: jrowley; Parent Key: 2055; Verified: False
U8 = 2056: Key: 2056; MENG_PN: ???2056; MANF: On Semiconductor; MANF_PN: EMI2121MTTAG; VENDOR: Digikey; VENDOR_PN: EMI2121MTTAGOSCT-ND; P&V Description: IC, Channel Protector, USB Common-Mode Filter and ESD Protection, WDFN-8, SMD; Class: IC; Other: USB Common-Mode Filter and ESD Protection; Approved: False; Type: Channel Protector; Package: WDFN-8; SMD: True; Date Modified: 6/13/2019 8:04:40 AM; Modified By: jrowley; Parent Key: 2056; Verified: False

## Sheet Probe-Scope Power v1.0.SchDoc: Probe-Scope: Power
size Letter; CompanyName: Probe-Scope; Organization: Probe-Scope; Address1: Probe-Scope: Unified USB; Address2: Oscilloscope Probe; Address3: ©2019 M. Omo, J. Rowley,; Address4: K. Hall, released under the; DocumentNumber: SCH0100; SheetNumber: 6; SheetTotal: 6; PageSetup: Record=PageOptions|CenterHorizontal=True|CenterVertical=True|PrintScale=0.96|XCorrection=1.00|YCorrection=1.00|PrintKind=1|BorderSize=5000000|LeftOffset=0|BottomOffset=0|Orientation=2|PaperLength=1000|PaperWidth=1000|Scale=100|PaperSource=7|PrintQuality=-4|MediaType=1|DitherType=10|PaperKind=11x17|PrintScaleMode=1; Assembly: ASP0100; License: CERN OHL v1.2
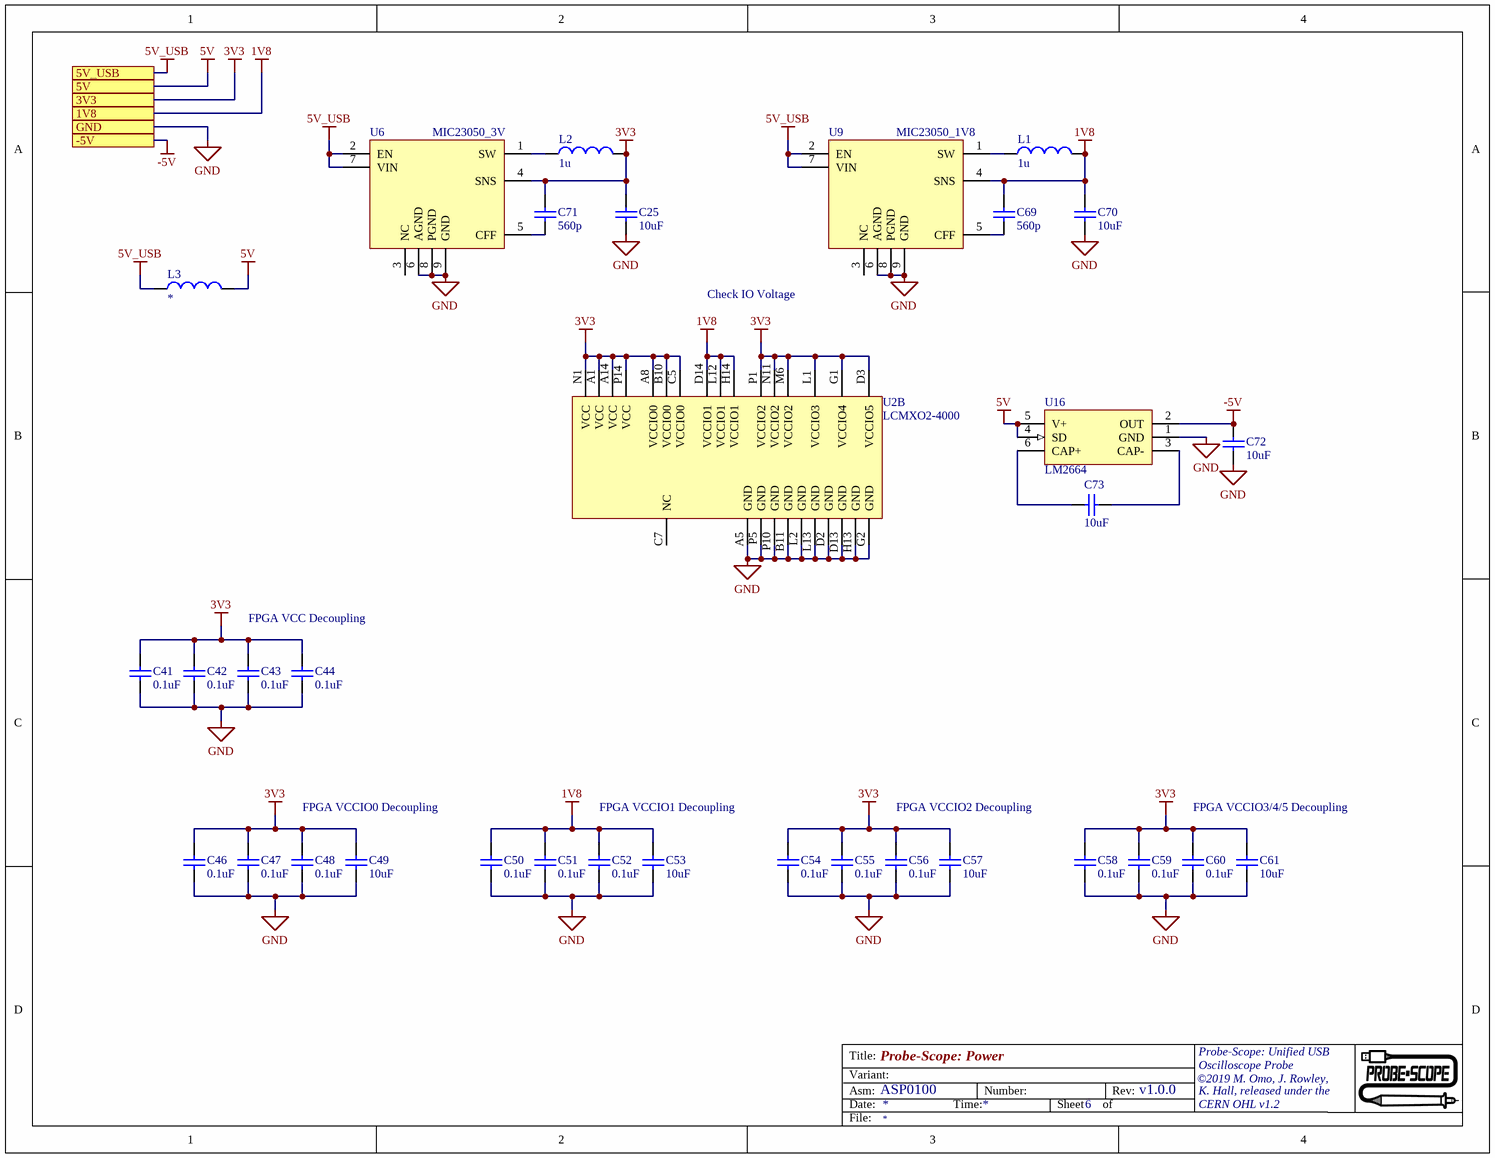
[diagram p5: Probe-Scope Power v1.0.SchDoc]

### Parts
C25  value 10uF  [0603(1608)]  (hidden comment: 25V)
C41  value 0.1uF  [0402(1005)]  (hidden comment: 6.3V)
C42  value 0.1uF  [0402(1005)]  (hidden comment: 6.3V)
C43  value 0.1uF  [0402(1005)]  (hidden comment: 6.3V)
C44  value 0.1uF  [0402(1005)]  (hidden comment: 6.3V)
C46  value 0.1uF  [0402(1005)]  (hidden comment: 6.3V)
C47  value 0.1uF  [0402(1005)]  (hidden comment: 6.3V)
C48  value 0.1uF  [0402(1005)]  (hidden comment: 6.3V)
C49  value 10uF  [0603(1608)]  (hidden comment: 25V)
C50  value 0.1uF  [0402(1005)]  (hidden comment: 6.3V)
C51  value 0.1uF  [0402(1005)]  (hidden comment: 6.3V)
C52  value 0.1uF  [0402(1005)]  (hidden comment: 6.3V)
C53  value 10uF  [0603(1608)]  (hidden comment: 25V)
C54  value 0.1uF  [0402(1005)]  (hidden comment: 6.3V)
C55  value 0.1uF  [0402(1005)]  (hidden comment: 6.3V)
C56  value 0.1uF  [0402(1005)]  (hidden comment: 6.3V)
C57  value 10uF  [0603(1608)]  (hidden comment: 25V)
C58  value 0.1uF  [0402(1005)]  (hidden comment: 6.3V)
C59  value 0.1uF  [0402(1005)]  (hidden comment: 6.3V)
C60  value 0.1uF  [0402(1005)]  (hidden comment: 6.3V)
C61  value 10uF  [0603(1608)]  (hidden comment: 25V)
C69  value 560p  [0402(1005)]  (hidden comment: Cap)
C70  value 10uF  [0603(1608)]  (hidden comment: 25V)
C71  value 560p  [0402(1005)]  (hidden comment: Cap)
C72  value 10uF  [0603(1608)]  (hidden comment: 25V)
C73  value 10uF  [0603(1608)]  (hidden comment: 25V)
L1  value 1u  [0603(1608)]  (hidden comment: Inductor)
L2  value 1u  [0603(1608)]  (hidden comment: Inductor)
L3  Ferrite Bead Y  [0805(2012)]  (value not drawn)
U2  LCMXO2-4000  [132_Ball_csBGA_MachXO2]  (part B of 5)
U6  MIC23050_3V  [MCP_8_MLF]
U9  MIC23050_1V8  [MCP_8_MLF]
U16  LM2664  [SOT95P280X145-6N]

### Ports
1V8, 3V3, 5V, 5V_USB, -5V, GND

### Nets
1V8: C50.2 C51.2 C52.2 C53.2 C69.2 C70.2 L1.2 U2.D14(VCCIO1) U2.H14(VCCIO1) U2.L12(VCCIO1) U9.4(SNS) ; port 1V8
3V3: C25.2 C41.2 C42.2 C43.2 C44.2 C46.2 C47.2 C48.2 C49.2 C54.2 C55.2 C56.2 C57.2 C58.2 C59.2 C60.2 C61.2 C71.2 L2.2 U2.A1(VCC) U2.A8(VCCIO0) U2.A14(VCC) U2.B10(VCCIO0) U2.C5(VCCIO0) U2.D3(VCCIO5) U2.G1(VCCIO4) U2.L1(VCCIO3) U2.M6(VCCIO2) U2.N1(VCC) U2.N11(VCCIO2) U2.P1(VCCIO2) U2.P14(VCC) U6.4(SNS) ; port 3V3
5V: L3.2 U16.4(SD) U16.5(V+) ; port 5V
5V_USB: L3.1 U6.2(EN) U6.7(VIN) U9.2(EN) U9.7(VIN) ; port 5V_USB
-5V: C72.2 U16.2(OUT) ; port -5V
GND: C25.1 C41.1 C42.1 C43.1 C44.1 C46.1 C47.1 C48.1 C49.1 C50.1 C51.1 C52.1 C53.1 C54.1 C55.1 C56.1 C57.1 C58.1 C59.1 C60.1 C61.1 C70.1 C72.1 U2.A5(GND) U2.B11(GND) U2.D2(GND) U2.D13(GND) U2.G2(GND) U2.H13(GND) U2.L2(GND) U2.L13(GND) U2.P5(GND) U2.P10(GND) U6.6(AGND) U6.8(PGND) U6.9(GND) U9.6(AGND) U9.8(PGND) U9.9(GND) U16.1(GND) ; port GND
NetC69_1: C69.1 U9.5(CFF)
NetC71_1: C71.1 U6.5(CFF)
NetC73_1: C73.1 U16.3(CAP-)
NetC73_2: C73.2 U16.6(CAP+)
NetL1_1: L1.1 U9.1(SW)
NetL2_1: L2.1 U6.1(SW)

Not connected (* = marked no-connect by the designer): U2 C7(NC); U6 3(NC); U9 3(NC)

### Notes on the sheet
- (near U9) Check IO Voltage
- FPGA VCC Decoupling
- FPGA VCCIO0 Decoupling
- FPGA VCCIO1 Decoupling
- FPGA VCCIO2 Decoupling
- FPGA VCCIO3/4/5 Decoupling
- Title:
- Asm:
- Date:
- Variant:
- Time:
- Number:
- Sheet
- of
- Rev:
- File:

### Library data of the parts
C25 C49 C53 C57 C61 C70 C72 C73 = 1306: as C37 on sheet Probe-Scope AFE v1.0; Package: 0603; SMD: True; Date Modified: 3/3/2015 11:08:29 AM; Modified By: sotterbacher; Parent Key: 1306; Verified: True
C41-C44 C46-C48 C50-C52 C54-C56 C58-C60 = 1875: as C11 on sheet Probe-Scope AFE v1.0; Package: 0402; SMD: True; Date Modified: 11/6/2018 11:14:02 AM; Modified By: jrowley; Parent Key: 1875; Verified: False
C69 C71 = 2112: Key: 2112; MENG_PN: ???2112; MANF: Samsung Electro-Mechanics; MANF_PN: CL05B561KB5NNNC; VENDOR: Digikey; VENDOR_PN: 1276-1577-1-ND; P&V Description: Capacitor, Electrolytic, 560p, 50V, 10% Tol, 0402, SMD; Class: Capacitor; Type: Electrolytic; Tolerance: 10; Voltage: 50; Approved: False; Package: 0402; SMD: True; Date Modified: 7/11/2019 9:37:04 PM; Modified By: momo; Parent Key: 2112; Verified: False
L1 L2 = 2111: Key: 2111; MENG_PN: ???2111; MANF: Taiyo Yuden; MANF_PN: MCKK1608T1R0MN; VENDOR: Digikey; VENDOR_PN: 587-5973-1-ND; P&V Description: Inductor, Shielded, 1u, 1.3A, 0.123 Ohms, 0603, SMD; Type: Shielded; Tolerance: 20; Current: 1.3; DCR: 0.123; Approved: False; Class: Inductor; Package: 0603; SMD: True; Date Modified: 7/11/2019 9:33:48 PM; Modified By: momo; Parent Key: 2111; Verified: False
L3 = 323: Key: 323; MENG_PN: IND00006; MANF: TDK; MANF_PN: MMZ2012Y121B; VENDOR: Digikey; VENDOR_PN: 445-2196-1-ND; P&V Description: Inductor, Ferrite Bead, 0.8A, 120 Ohm at 100MHz, Effective from 80MHz To 400MHz, Y Material, 0805, SMD; Other: 120 Ohm at 100MHz, Effective from 80MHz To 400MHz, Y Material; Current: 0.8; Approved: True; Value: *; Class: Inductor; Type: Ferrite Bead; Package: 0805; SMD: True; Date Modified: 8/6/2009 8:13:58 AM; Modified By: pmarcus; Parent Key: 323; Verified: True
U2 = MachXO2-4000: as U2 on sheet Probe-Scope ADC v1.0
U6 = MIC23050_3V: MANF: Microchip; MANF_PN: MIC23050-SYML-TR; VENDOR: Digikey; VENDOR_PN: 576-3351-1-ND
U9 = MIC23050_1V8: MANF: Microchip; MANF_PN: MIC23050-GYML-TR; VENDOR: Digikey; VENDOR_PN: 576-2974-1-ND
U16 = LM2664: MANF: Texas Instruments; MANF_PN: LM2664M6X/NOPB; VENDOR: DigiKey; VENDOR_PN: LM2664M6X/NOPBCT-ND

## Nets that join several sheets
1V8: Probe-Scope RAM v1.0 (7 pins), Probe-Scope Power v1.0 (11 pins)
3V3: Probe-Scope AFE v1.0 (16 pins), Probe-Scope ADC v1.0 (21 pins), Probe-Scope Controller v1.0 (25 pins), Probe-Scope Power v1.0 (33 pins)
5V: Probe-Scope AFE v1.0 (15 pins), Probe-Scope Power v1.0 (L3.2 U16.4 U16.5)
5V_USB: Probe-Scope Controller v1.0 (C12.2 C13.2 P3.1 U3.33), Probe-Scope Power v1.0 (5 pins)
-5V: Probe-Scope AFE v1.0 (12 pins), Probe-Scope Power v1.0 (C72.2 U16.2)
GND: Probe-Scope AFE v1.0 (32 pins), Probe-Scope ADC v1.0 (25 pins), Probe-Scope RAM v1.0 (7 pins), Probe-Scope Controller v1.0 (37 pins), Probe-Scope Power v1.0 (40 pins)
DAC_RDY: Probe-Scope AFE v1.0 (U15.5), Probe-Scope Controller v1.0 (U3.30)
~{LDAC}: Probe-Scope AFE v1.0 (U15.4), Probe-Scope Controller v1.0 (U3.50)
~{SS3}: Probe-Scope ADC v1.0 (U2.N12), Probe-Scope Controller v1.0 (U3.18)
~{SS4}: Probe-Scope AFE v1.0 (U14.3), Probe-Scope Controller v1.0 (U3.21)
SCK3: Probe-Scope ADC v1.0 (U2.M4), Probe-Scope Controller v1.0 (U3.29)
SCK4: Probe-Scope AFE v1.0 (U14.4), Probe-Scope Controller v1.0 (U3.44)
SCL4: Probe-Scope AFE v1.0 (U15.2), Probe-Scope Controller v1.0 (R17.1 U3.6)
SDA4: Probe-Scope AFE v1.0 (U15.3), Probe-Scope Controller v1.0 (R16.1 U3.5)
SDI3: Probe-Scope ADC v1.0 (U2.N4), Probe-Scope Controller v1.0 (U3.57)
SDI4: Probe-Scope AFE v1.0 (U14.6), Probe-Scope Controller v1.0 (U3.42)
SDO3: Probe-Scope ADC v1.0 (U2.P13), Probe-Scope Controller v1.0 (U3.56)
SDO4: Probe-Scope AFE v1.0 (U14.5), Probe-Scope Controller v1.0 (U3.51)
Vin_N: Probe-Scope AFE v1.0 (U14.18), Probe-Scope ADC v1.0 (U1.38)
Vin_P: Probe-Scope AFE v1.0 (U14.17), Probe-Scope ADC v1.0 (U1.39)

## Assembly variants
Standard Config: not fitted C74 C75 P1 P2 P4 P5 P6
Normal: all parts fitted